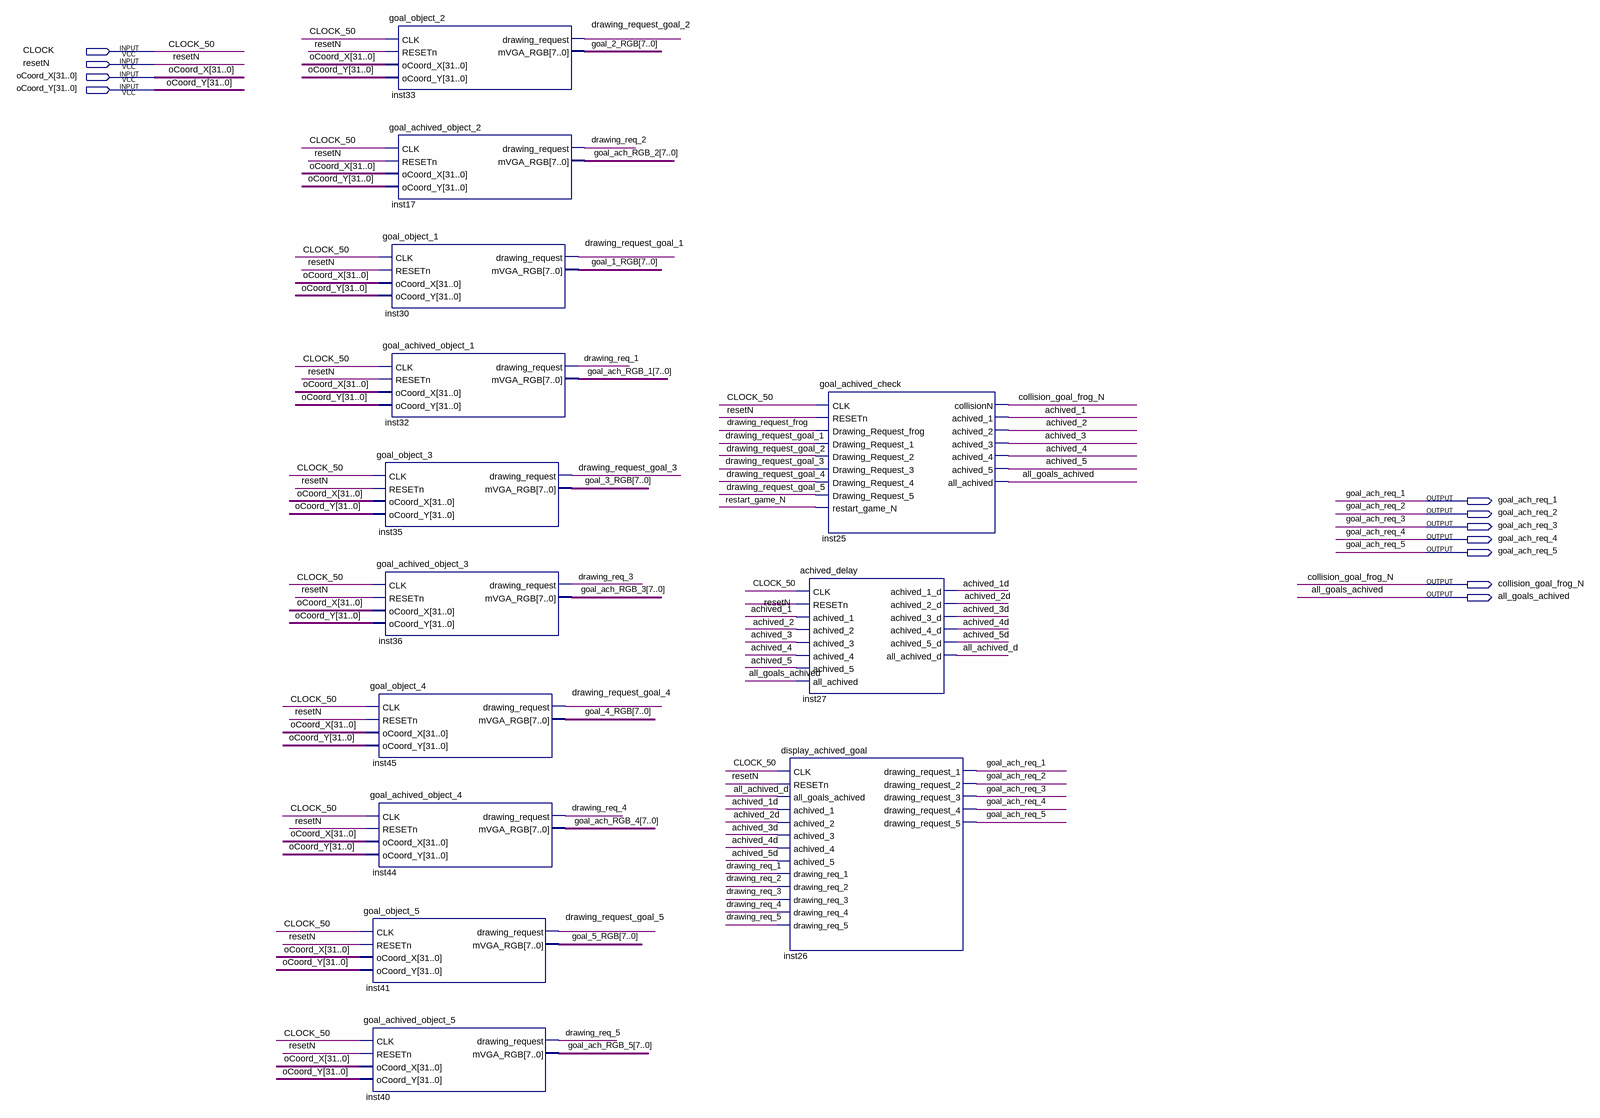
[diagram p0: schematic sheet]
// Quartus schematic goals_handler.bdf as structural Verilog: 13 symbols, 11 pins
module goals_handler (
  input  CLOCK,
  input  resetN,
  input  [31:0] oCoord_X,
  input  [31:0] oCoord_Y,
  output goal_ach_req_1,
  output goal_ach_req_2,
  output goal_ach_req_3,
  output goal_ach_req_4,
  output goal_ach_req_5,
  output collision_goal_frog_N,
  output all_goals_achived
);

  wire achived_1, achived_1d, achived_2, achived_2d, achived_3, achived_3d, achived_4, achived_4d, achived_5,
       achived_5d, all_achived_d, drawing_req_1, drawing_req_2, drawing_req_3, drawing_req_4, drawing_req_5,
       drawing_request_frog, drawing_request_goal_1, drawing_request_goal_2, drawing_request_goal_3,
       drawing_request_goal_4, drawing_request_goal_5, restart_game_N;
  wire [7:0] goal_1_RGB, goal_2_RGB, goal_3_RGB, goal_4_RGB, goal_5_RGB, goal_ach_RGB_1, goal_ach_RGB_2,
       goal_ach_RGB_3, goal_ach_RGB_4, goal_ach_RGB_5;

  goal_object_2 inst33 (
    .CLK(CLOCK), .RESETn(resetN), .oCoord_X(oCoord_X), .oCoord_Y(oCoord_Y),
    .drawing_request(drawing_request_goal_2), .mVGA_RGB(goal_2_RGB));
  goal_achived_object_2 inst17 (
    .CLK(CLOCK), .RESETn(resetN), .oCoord_X(oCoord_X), .oCoord_Y(oCoord_Y), .drawing_request(drawing_req_2),
    .mVGA_RGB(goal_ach_RGB_2));
  goal_object_1 inst30 (
    .CLK(CLOCK), .RESETn(resetN), .oCoord_X(oCoord_X), .oCoord_Y(oCoord_Y),
    .drawing_request(drawing_request_goal_1), .mVGA_RGB(goal_1_RGB));
  goal_achived_object_1 inst32 (
    .CLK(CLOCK), .RESETn(resetN), .oCoord_X(oCoord_X), .oCoord_Y(oCoord_Y), .drawing_request(drawing_req_1),
    .mVGA_RGB(goal_ach_RGB_1));
  goal_object_3 inst35 (
    .CLK(CLOCK), .RESETn(resetN), .oCoord_X(oCoord_X), .oCoord_Y(oCoord_Y),
    .drawing_request(drawing_request_goal_3), .mVGA_RGB(goal_3_RGB));
  goal_achived_object_3 inst36 (
    .CLK(CLOCK), .RESETn(resetN), .oCoord_X(oCoord_X), .oCoord_Y(oCoord_Y), .drawing_request(drawing_req_3),
    .mVGA_RGB(goal_ach_RGB_3));
  goal_object_4 inst45 (
    .CLK(CLOCK), .RESETn(resetN), .oCoord_X(oCoord_X), .oCoord_Y(oCoord_Y),
    .drawing_request(drawing_request_goal_4), .mVGA_RGB(goal_4_RGB));
  goal_achived_object_4 inst44 (
    .CLK(CLOCK), .RESETn(resetN), .oCoord_X(oCoord_X), .oCoord_Y(oCoord_Y), .drawing_request(drawing_req_4),
    .mVGA_RGB(goal_ach_RGB_4));
  goal_object_5 inst41 (
    .CLK(CLOCK), .RESETn(resetN), .oCoord_X(oCoord_X), .oCoord_Y(oCoord_Y),
    .drawing_request(drawing_request_goal_5), .mVGA_RGB(goal_5_RGB));
  goal_achived_object_5 inst40 (
    .CLK(CLOCK), .RESETn(resetN), .oCoord_X(oCoord_X), .oCoord_Y(oCoord_Y), .drawing_request(drawing_req_5),
    .mVGA_RGB(goal_ach_RGB_5));
  goal_achived_check inst25 (
    .CLK(CLOCK), .RESETn(resetN), .Drawing_Request_frog(drawing_request_frog),
    .Drawing_Request_1(drawing_request_goal_1), .Drawing_Request_2(drawing_request_goal_2),
    .Drawing_Request_3(drawing_request_goal_3), .Drawing_Request_4(drawing_request_goal_4),
    .Drawing_Request_5(drawing_request_goal_5), .restart_game_N(restart_game_N), .achived_1(achived_1),
    .achived_2(achived_2), .achived_3(achived_3), .achived_4(achived_4), .achived_5(achived_5),
    .collisionN(collision_goal_frog_N), .all_achived(all_goals_achived));
  achived_delay inst27 (
    .CLK(CLOCK), .RESETn(resetN), .achived_1(achived_1), .achived_2(achived_2), .achived_3(achived_3),
    .achived_4(achived_4), .achived_5(achived_5), .all_achived(all_goals_achived), .achived_1_d(achived_1d),
    .achived_2_d(achived_2d), .achived_3_d(achived_3d), .achived_4_d(achived_4d), .achived_5_d(achived_5d),
    .all_achived_d(all_achived_d));
  display_achived_goal inst26 (
    .CLK(CLOCK), .RESETn(resetN), .all_goals_achived(all_achived_d), .achived_1(achived_1d),
    .achived_2(achived_2d), .achived_3(achived_3d), .achived_4(achived_4d), .achived_5(achived_5d),
    .drawing_req_1(drawing_req_1), .drawing_req_2(drawing_req_2), .drawing_req_3(drawing_req_3),
    .drawing_req_4(drawing_req_4), .drawing_req_5(drawing_req_5), .drawing_request_1(goal_ach_req_1),
    .drawing_request_2(goal_ach_req_2), .drawing_request_3(goal_ach_req_3),
    .drawing_request_4(goal_ach_req_4), .drawing_request_5(goal_ach_req_5));

  // Other names for the same wires on the sheet: CLOCK_50 = CLOCK
endmodule
